# EAGLE design sherlock (EAGLE 6.5.0)
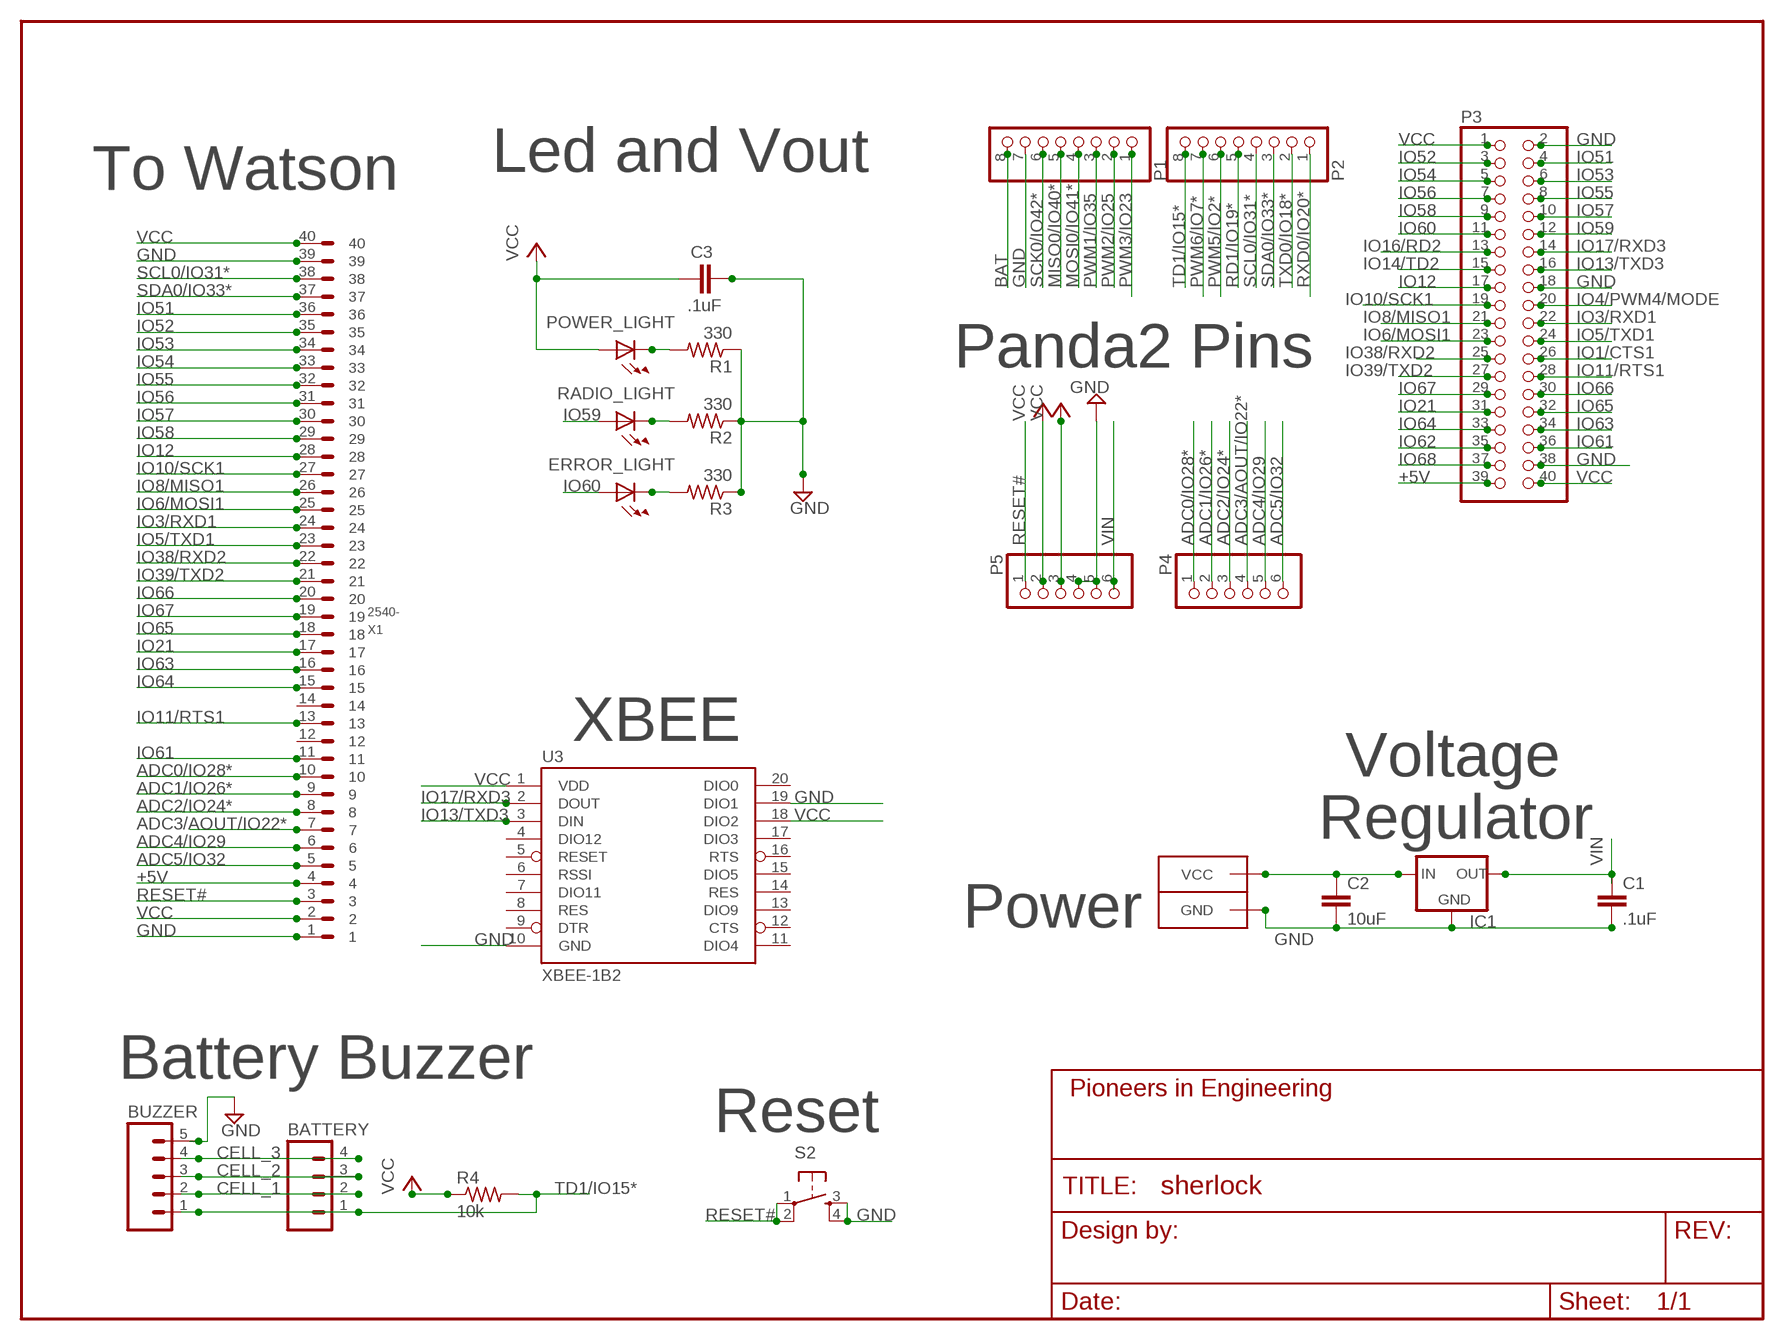
[diagram p0: schematic, sheet 1]
FRAME1 (FRAME-LETTER): AUTHOR: Sahar M, Michael C, Sumita G, Aravind K; REVISION: C

## Parts
BATTERY  M041X04-MTA  [1X04-MTA]
BUZZER  M05PTH  [1X05]
C1  .1uF  CAP0603-CAP  [0603-CAP]
C2  10uF  CAP0603-CAP  [0603-CAP]
C3  .1uF  CAP0603-CAP  [0603-CAP]
ERROR_LIGHT  LED0805  [LED-0805]
IC1  V_REG_78XXSIDE  [78XXL]
P1  PINHD-1X8  [1X08]
P2  PINHD-1X8  [1X08]
P3  PINHD-2X20  [2X20]
P4  PINHD-1X6  [1X06]
P5  PINHD-1X6  [1X06]
POWER  ANDERSONHORIZONTAL  [ANDERSON_HORIZONTAL]
POWER_LIGHT  LED0805  [LED-0805]
R1  330  R-US_R0603  [R0603]
R2  330  R-US_R0603  [R0603]
R3  330  R-US_R0603  [R0603]
R4  10k  R-US_R0603  [R0603]
RADIO_LIGHT  LED0805  [LED-0805]
S2  TAC_SWITCHPTH  [TACTILE-PTH]
U3  XBEE-1B2  [XBEE-SILK]
X1  2540-  [PAK100/2500-40]

## Nets
12V: C2.1 IC1.IN POWER.PIN2(VCC)
+5V [power]: P3.39 P5.3 X1.4 ; supply symbol labelled VCC
ADC0/IO28*: P4.1 X1.10
ADC1/IO26*: P4.2 X1.9
ADC2/IO24*: P4.3 X1.8
ADC3/AOUT/IO22*: P4.4 X1.7
ADC4/IO29: P4.5 X1.6
ADC5/IO32: P4.6 X1.5
BAT: P1.8
CELL_1: BATTERY.2 BUZZER.2
CELL_2: BATTERY.3 BUZZER.3
CELL_3: BATTERY.4 BUZZER.4
GND: BUZZER.5 C1.2 C2.2 C3.2 IC1.GND P1.7 P3.2 P3.18 P3.38 P5.4 P5.5 POWER.PIN1(GND) R1.1 R2.1 R3.1 S2.3 S2.4 U3.10(GND) U3.19(DIO1) X1.1 X1.39
IO1/CTS1: P3.26
IO3/RXD1: P3.22 X1.24
IO4/PWM4/MODE: P3.20
IO5/TXD1: P3.24 X1.23
IO6/MOSI1: P3.23 X1.25
IO8/MISO1: P3.21 X1.26
IO10/SCK1: P3.19 X1.27
IO11/RTS1: P3.28 X1.13
IO12: P3.17 X1.28
IO13/TXD3: P3.16 U3.3(DIN)
IO14/TD2: P3.15
IO16/RD2: P3.13
IO17/RXD3: P3.14 U3.2(DOUT)
IO21: P3.31 X1.17
IO38/RXD2: P3.25 X1.22
IO39/TXD2: P3.27 X1.21
IO51: P3.4 X1.36
IO52: P3.3 X1.35
IO53: P3.6 X1.34
IO54: P3.5 X1.33
IO55: P3.8 X1.32
IO56: P3.7 X1.31
IO57: P3.10 X1.30
IO58: P3.9 X1.29
IO59: P3.12 RADIO_LIGHT.A
IO60: ERROR_LIGHT.A P3.11
IO61: P3.36 X1.11
IO62: P3.35
IO63: P3.34 X1.16
IO64: P3.33 X1.15
IO65: P3.32 X1.18
IO66: P3.30 X1.20
IO67: P3.29 X1.19
IO68: P3.37
MISO0/IO40*: P1.5
MOSI0/IO41*: P1.4
N$2: POWER_LIGHT.C R1.2
N$3: R2.2 RADIO_LIGHT.C
N$4: ERROR_LIGHT.C R3.2
PWM1/IO35: P1.3
PWM2/IO25: P1.2
PWM3/IO23: P1.1
PWM5/IO2*: P2.6
PWM6/IO7*: P2.7
RD1/IO19*: P2.5
RESET#: P5.1 S2.1 S2.2 X1.3
RXD0/IO20*: P2.1
SCK0/IO42*: P1.6
SCL0/IO31*: P2.4 X1.38
SDA0/IO33*: P2.3 X1.37
TD1/IO15*: BATTERY.1 BUZZER.1 P2.8 R4.2
TXD0/IO18*: P2.2
VCC [power]: C3.1 P3.1 P3.40 P5.2 POWER_LIGHT.A R4.1 U3.1(VDD) U3.18(DIO2) X1.2 X1.40
VIN: C1.1 IC1.OUT P5.6
Unconnected: U3.4(DIO12) U3.5(RESET) U3.6(RSSI) U3.7(DIO11) U3.8(RES) U3.9(DTR) U3.11(DIO4) U3.12(CTS) U3.13(DIO9) U3.14(RES) U3.15(DIO5) U3.16(RTS) U3.17(DIO3) U3.20(DIO0) X1.12 X1.14

## Notes on the sheet
- To Watson | Led and Vout
- Panda2 Pins
- XBEE
- Voltage
- Regulator
- Power
- Battery Buzzer
- Reset

## Library data of the parts
BATTERY = pie:M04: 4-pin 0.1-inch header and MTA connector; PARTNUMBER: A1922-ND
BUZZER = pie:M05: 5-pin 0.1-inch header and MTA connector; PARTNUMBER: 965
C1-C3 = pie:CAP: Capacitor Standard 0603 ceramic capacitor, and 0.1" leaded capacitor.
ERROR_LIGHT POWER_LIGHT RADIO_LIGHT = pie:LED: LEDs Standard schematic elements and footprints for 5mm, 3mm, 1206, and 0603 sized LEDs. 5mm - Spark Fun Electronics SKU : COM-00529 (and others)
IC1 = pie:V_REG_78XX: Voltage Regulator Standard 7805 5V regulator. IGO (Input Ground Output). Spark Fun Electronics SKU : COM-00107; PARTNUMBER: 497-1446-5-ND
P1 P2 = pie:PINHD-1X8: 8-pin 0.1-inch header; PARTNUMBER: 965
P3 = pie:PINHD-2X20: 2x20-pin 0.1-inch header; PARTNUMBER: 966
P4 P5 = pie:PINHD-1X6: 6-pin 0.1-inch header; PARTNUMBER: 965
POWER = pie:ANDERSON: 2-pin 25A Anderson Connector http://www.alliedelec.com/images/products/datasheets/bm/ANDERSON_POWER_PRODUCTS/70162018.pdf; PARTNUMBER: 1377G1
R1-R4 = pie:R-US_: RESISTOR, American symbol
S2 = pie:TAC_SWITCH: Momentary Switch Button commonly used for reset or general input. Spark Fun Electronics SKU : COM-00097; PARTNUMBER: S5751-10-ND
U3 = pie:XBEE-1: XBee Header; PARTNUMBER: S5751-10-ND
X1 = pie:2540-: 3M (TM) Pak 100 4-Wall Header Source: 3M; OC_FARNELL: unknown; OC_NEWARK: unknown; PARTNUMBER: S9175-ND

## Net classes
1 power: width 0.406 mm, drill 0.381 mm, clearance 0.203 mm

## Board
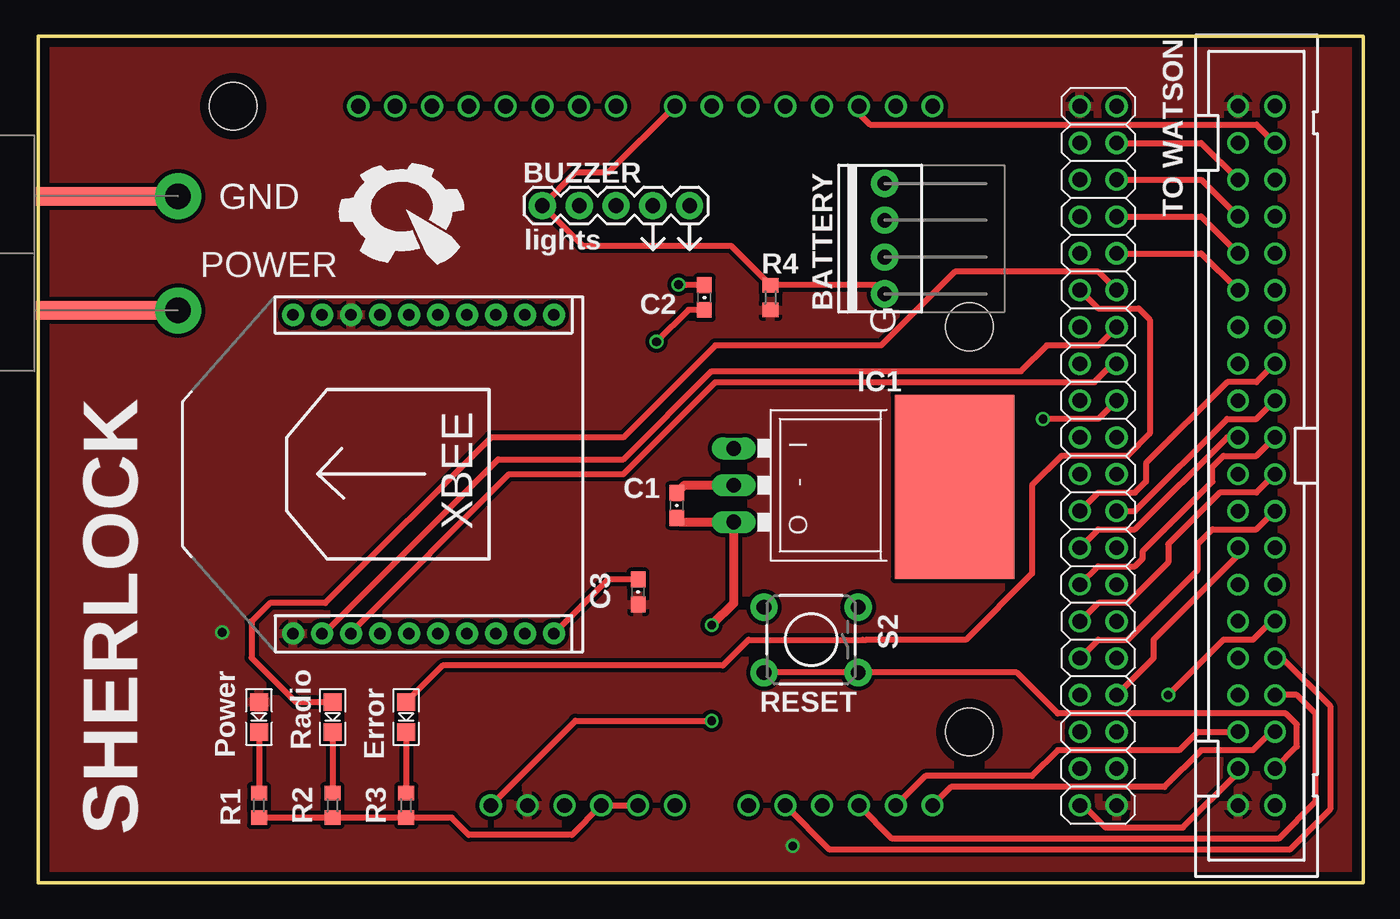
[diagram p1: board, top side]
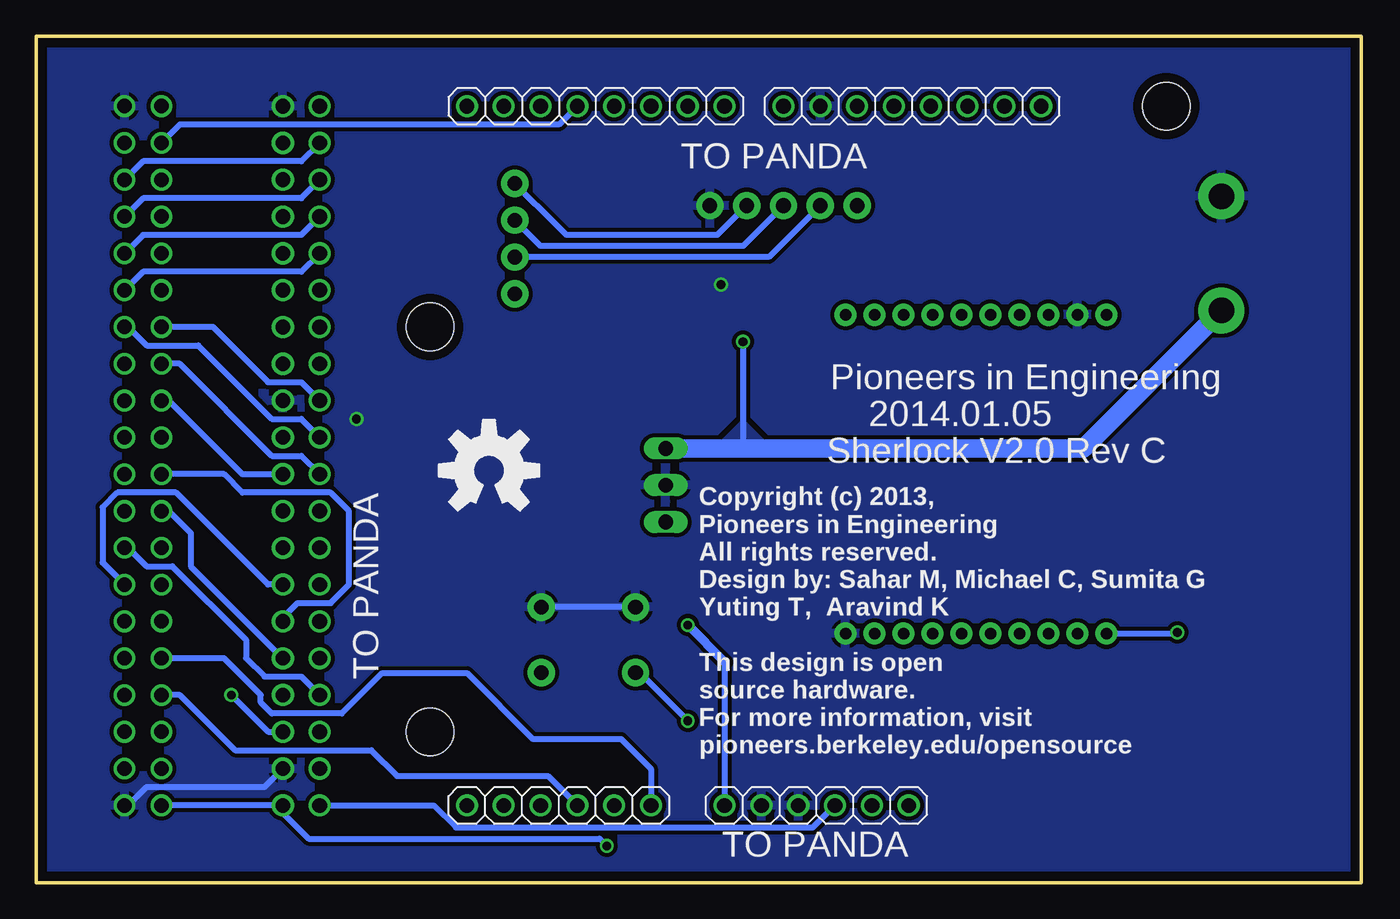
[diagram p2: board, bottom side, seen from below]

Size 91.44 x 58.42 mm. Coordinates in mm from the lower left corner, seen from the top.
Outline: 0,0 91.44,0 91.44,58.42 0,58.42 0,0
Copper layers (1*16): Top 2mil / dielectric 9mil / Bottom 2mil
Design rules "advancedcircuits-33each-pie": minimum track width 6mil, minimum drill 15mil, track to track 6mil, track to pad 10mil, pad to pad 6mil, via to via 6mil, smd to smd 6mil, copper to edge 25mil, drill to drill 7mil, minimum pad ring 7mil, minimum via ring 7mil, stop-mask expansion 3mil, vias tented up to drill 0mil, thermal gap 10mil

### Footprints (pad centres in the part's own frame; a part is rotated, then mirrored left to right if it is on the bottom)
1X04-MTA = drill 1.016 pad 1.88: 1 -3.81,0; 2 -1.27,0; 3 1.27,0; 4 3.81,0
1X05 = drill 1.016 pad 1.88: 1 -5.08,0; 2 -2.54,0; 3 0,0; 4 2.54,0; 5 5.08,0
0603-CAP = smd 1.1 x 1: 1 -0.85,0; 2 0.85,0
LED-0805 = smd 1.194 x 1.245: A -1.041,0; C 1.041,0
78XXL = drill 1.016 pad 1.524 long: GND 0,-8.89; IN -2.54,-8.89; OUT 2.54,-8.89 | smd 12.7 x 8.255: PAD 0.127,6.35
1X08 = drill 1.016 pad 1.524: 1 -8.89,0; 2 -6.35,0; 3 -3.81,0; 4 -1.27,0; 5 1.27,0; 6 3.81,0; 7 6.35,0; 8 8.89,0
2X20 = drill 1.016 pad 1.524: 1 -24.13,-1.27; 2 -24.13,1.27; 3 -21.59,-1.27; 4 -21.59,1.27; 5 -19.05,-1.27; 6 -19.05,1.27; 7 -16.51,-1.27; 8 -16.51,1.27; 9 -13.97,-1.27; 10 -13.97,1.27; 11 -11.43,-1.27; 12 -11.43,1.27; 13 -8.89,-1.27; 14 -8.89,1.27; 15 -6.35,-1.27; 16 -6.35,1.27; 17 -3.81,-1.27; 18 -3.81,1.27; 19 -1.27,-1.27; 20 -1.27,1.27; 21 1.27,-1.27; 22 1.27,1.27; 23 3.81,-1.27; 24 3.81,1.27; 25 6.35,-1.27; 26 6.35,1.27; 27 8.89,-1.27; 28 8.89,1.27; 29 11.43,-1.27; 30 11.43,1.27; 31 13.97,-1.27; 32 13.97,1.27; 33 16.51,-1.27; 34 16.51,1.27; 35 19.05,-1.27; 36 19.05,1.27; 37 21.59,-1.27; 38 21.59,1.27; 39 24.13,-1.27; 40 24.13,1.27
1X06 = drill 1.016 pad 1.524: 1 -6.35,0; 2 -3.81,0; 3 -1.27,0; 4 1.27,0; 5 3.81,0; 6 6.35,0
ANDERSON_HORIZONTAL = smd 8.89 x 1.27: P$1 -5.334,3.937; P$3 -5.334,-3.937 | drill 1.778 pad 3.175: PIN1 0,3.937; PIN2 0,-3.937
R0603 = smd 1 x 1.1: 1 -0.85,0; 2 0.85,0
TACTILE-PTH = drill 1.016 pad 1.88: 1 -3.251,2.261; 2 3.251,2.261; 3 -3.251,-2.261; 4 3.251,-2.261
XBEE-SILK = drill 0.8 pad 1.524: 1 -11,6.03; 2 -11,4.03; 3 -11,2.03; 4 -11,0.03; 5 -11,-1.97; 6 -11,-3.97; 7 -11,-5.97; 8 -11,-7.97; 9 -11,-9.97; 10 -11,-11.97; 11 11,-11.97; 12 11,-9.97; 13 11,-7.97; 14 11,-5.97; 15 11,-3.97; 16 11,-1.97; 17 11,0.03; 18 11,2.03; 19 11,4.03; 20 11,6.03
STAND-OFF = hole 3.302: 0,0
PAK100/2500-40 = drill 1 pad 1.5: 1 -24.13,-1.27; 2 -24.13,1.27; 3 -21.59,-1.27; 4 -21.59,1.27; 5 -19.05,-1.27; 6 -19.05,1.27; 7 -16.51,-1.27; 8 -16.51,1.27; 9 -13.97,-1.27; 10 -13.97,1.27; 11 -11.43,-1.27; 12 -11.43,1.27; 13 -8.89,-1.27; 14 -8.89,1.27; 15 -6.35,-1.27; 16 -6.35,1.27; 17 -3.81,-1.27; 18 -3.81,1.27; 19 -1.27,-1.27; 20 -1.27,1.27; 21 1.27,-1.27; 22 1.27,1.27; 23 3.81,-1.27; 24 3.81,1.27; 25 6.35,-1.27; 26 6.35,1.27; 27 8.89,-1.27; 28 8.89,1.27; 29 11.43,-1.27; 30 11.43,1.27; 31 13.97,-1.27; 32 13.97,1.27; 33 16.51,-1.27; 34 16.51,1.27; 35 19.05,-1.27; 36 19.05,1.27; 37 21.59,-1.27; 38 21.59,1.27; 39 24.13,-1.27; 40 24.13,1.27

### Placement (x,y rotation side)
BATTERY  58.42,44.45 90 top
BUZZER  39.88,46.74 0 top
C1  44.07,26.04 90 top
C2  45.97,40.39 90 top
C3  41.4,20.07 90 top
ERROR_LIGHT  25.4,11.43 270 top
IC1  56.9,27.43 270 top
P1  30.99,53.59 180 bottom
P2  52.83,53.59 0 bottom
P3  73.15,29.46 270 top
P4  55.37,5.33 180 bottom
P5  37.59,5.33 180 bottom
POWER  9.65,43.43 0 top
POWER_LIGHT  15.24,11.43 270 top
R1  15.24,5.33 90 top
R2  20.32,5.33 90 top
R3  25.4,5.33 90 top
R4  50.55,40.39 90 top
RADIO_LIGHT  20.32,11.43 270 top
S2  53.34,16.76 180 top
U3  23.62,28.19 90 top
U$1  [PIE-LOGO-SMALL]  25.4,46.48 0 top
U$3  Mounting + Test  [STAND-OFF]  64.26,38.35 0 top
U$4  Mounting  [STAND-OFF]  64.26,10.41 0 top
U$5  Mounting  [STAND-OFF]  13.46,53.59 0 top
U$7  [OSHW-LOGO-L]  60.2,28.45 0 bottom
X1  84.07,29.46 90 top

### Tracks (layer width: path | path; a pad name or v marks a point on that pad's centre or on a via)
12V  (via drill 0.6)
  Top 0.406: C2.1 44.87,39.54 v42.67,37.34
  Bottom 0.406: v42.67,37.34 42.67,30.23 42.93,29.97
  Bottom 1.27: IC1.IN 42.93,29.97 19.18,29.97 POWER.PIN2
  pour Bottom: 41.4,30.48 42.67,31.75 43.94,30.48
+5V
  Top 0.406: P3.39 72.14,5.33 73.66,3.81 78.99,3.81 82.68,7.49 82.8,7.49 X1.4
  Bottom 0.406: P3.39 64.01,5.33 62.48,3.81 37.85,3.81 P5.3
ADC0/IO28*
  Bottom 0.406: X1.10 78.49,15.49 75.95,12.95 75.95,12.45 75.18,11.68 70.36,11.68 67.56,14.48 61.72,14.48 57.15,9.91 51.05,9.91 49.02,7.87 P4.1
ADC1/IO26*
  Top 0.406: X1.9 85.85,15.49 89.15,12.19 89.15,5.08 86.36,2.29 54.61,2.29 P4.2
ADC2/IO24*
  Bottom 0.406: X1.8 81.53,12.95 77.72,9.14 68.33,9.14 66.55,7.37 56.13,7.37 P4.3
ADC3/AOUT/IO22*
  Top 0.406: X1.7 86.87,12.95 88.14,11.68 88.14,5.59 85.6,3.05 58.93,3.05 P4.4
ADC4/IO29
  Top 0.406: X1.6 80.01,10.41 78.74,9.14 70.36,9.14 68.58,7.37 61.21,7.37 P4.5
ADC5/IO32
  Top 0.406: X1.5 85.09,10.41 83.82,9.14 80.26,9.14 77.72,6.6 62.99,6.6 P4.6
CELL_1
  Bottom 0.406: BUZZER.2 40.89,43.18 BATTERY.2
CELL_2
  Bottom 0.406: BUZZER.3 42.67,43.94 56.64,43.94 BATTERY.3
CELL_3
  Bottom 0.406: BATTERY.4 55.5,45.34 55.37,45.21 54.86,44.7 44.45,44.7 BUZZER.4
GND  (via drill 0.6)
  Top 0.406: P5.5 P5.4 36.83,3.3 29.72,3.3 28.54,4.48 R3.1 R2.1 R1.1 | P3.18 73.15,32 v69.34,32 | C3.2 41.38,20.94 39.34,20.94 U3.10 | C2.2 44.23,41.24 v44.2,41.27
  Top 0.61: C1.2 44.62,27.43 IC1.GND
  Bottom 0.406: 85.09,5.33 83.82,6.6 75.69,6.6 P3.38 | S2.4 S2.3
  pour Bottom (isolate 0.279, rank 2): 0,0 91.44,0 91.44,58.42 0,58.42
IO3/RXD1
  Bottom 0.406: P3.22 77.22,28.19 82.3,33.27 X1.24
IO5/TXD1
  Top 0.406: P3.24 75.69,25.65 82.04,32 84.07,32 X1.23
IO6/MOSI1
  Top 0.406: X1.25 84.07,34.54 82.04,34.54 76.45,28.96 76.45,27.69 75.69,26.92 73.15,26.92 P3.23
IO8/MISO1
  Bottom 0.406: P3.21 73.15,29.46 75.18,29.46 81.53,35.81 X1.26
IO10/SCK1
  Bottom 0.406: P3.19 73.15,32 75.18,32 80.26,37.08 83.82,37.08 85.09,38.35 X1.27
IO11/RTS1
  Bottom 0.406: P3.28 75.44,20.57 81.79,26.92 85.85,26.92 86.87,25.91 86.87,22.1 X1.13
IO12
  Bottom 0.406: P3.17 73.15,34.54 75.44,34.54 79.25,38.35 X1.28
IO13/TXD3
  Top 0.406: U3.3 21.59,17.27 32.51,28.19 40.39,28.19 46.74,34.54 72.9,34.54 74.17,35.81 P3.16
IO17/RXD3
  Top 0.406: P3.14 73.15,37.08 69.6,37.08 67.82,35.31 46.48,35.31 40.39,29.21 31.75,29.21 19.73,17.19 U3.2
IO21
  Top 0.406: P3.31 73.15,16.76 75.18,16.76 80.01,21.59 80.01,23.37 81.03,24.38 84.07,24.38 X1.17
IO38/RXD2
  Top 0.406: P3.25 73.15,24.38 75.69,24.38 82.04,30.73 X1.22
IO39/TXD2
  Top 0.406: P3.27 73.15,21.84 75.69,21.84 76.2,22.35 76.2,22.86 81.03,27.69 81.03,28.7 81.79,29.46 84.07,29.46 X1.21
IO51
  Top 0.406: P3.4 80.26,51.05 X1.36
IO52
  Bottom 0.406: P3.3 73.15,49.78 84.07,49.78 X1.35
IO53
  Top 0.406: P3.6 80.26,48.51 X1.34
IO54
  Bottom 0.406: P3.5 73.15,47.24 84.07,47.24 X1.33
IO55
  Top 0.406: P3.8 80.26,45.97 X1.32
IO56
  Bottom 0.406: P3.7 73.15,44.7 84.07,44.7 X1.31
IO57
  Top 0.406: P3.10 80.26,43.43 X1.30
IO58
  Bottom 0.406: P3.9 73.15,42.16 84.07,42.16 X1.29
IO59
  Top 0.406: P3.12 73.15,42.16 63.25,42.16 58.17,37.08 46.74,37.08 40.39,30.73 31.24,30.73 19.81,19.3 16,19.3 14.73,18.03 14.73,15.52 17.78,12.47 RADIO_LIGHT.A
IO60
  Top 0.406: P3.11 73.15,39.62 75.95,39.62 76.71,38.86 76.71,30.99 75.18,29.46 70.61,29.46 68.58,27.43 68.58,21.34 64.01,16.76 57.15,16.76 56.9,16.76 49.02,16.76 47.24,14.99 27.91,14.99 ERROR_LIGHT.A
IO61  (via drill 0.6)
  Top 0.406: v77.98,12.95 81.79,16.76 83.82,16.76 85.09,18.03 X1.11
  Bottom 0.406: v77.98,12.95 75.44,10.41 P3.36
IO63
  Top 0.406: P3.34 76.96,15.49 76.96,16.76 82.68,22.48 82.68,22.99 X1.16
IO64
  Bottom 0.406: P3.33 73.15,14.22 75.69,14.22 76.96,15.49 76.96,16.76 82.04,21.84 83.82,21.84 84.71,22.73 84.96,22.73 X1.15
IO65
  Bottom 0.406: P3.32 80.77,21.84 80.77,24.13 82.3,25.65 X1.18
IO66
  Bottom 0.406: P3.30 74.42,18.29 73.41,19.3 71.12,19.3 69.85,20.57 69.85,25.65 71.12,26.92 77.22,26.92 78.49,28.19 X1.20
IO67
  Top 0.406: P3.29 73.15,19.3 75.18,19.3 77.98,22.1 77.98,23.37 81.53,26.92 84.07,26.92 X1.19
N$2
  Top 0.406: POWER_LIGHT.C R1.2
N$3
  Top 0.406: RADIO_LIGHT.C R2.2
N$4
  Top 0.406: ERROR_LIGHT.C R3.2
RESET#  (via drill 0.6)
  Top 0.406: v46.48,11.18 37.08,11.18 P5.1 | X1.3 86.87,9.4 86.87,10.92 86.11,11.68 70.36,11.68 67.54,14.5 S2.1 S2.2
  Bottom 0.406: v46.48,11.18 49.81,14.5 S2.2
SCL0/IO31*
  Bottom 0.406: X1.38 81.53,52.32 55.37,52.32 P2.4
SDA0/IO33*
  Top 0.406: X1.37 84.07,52.32 57.4,52.32 56.64,53.09 P2.3
TD1/IO15*
  Top 0.406: BATTERY.1 57.82,41.24 R4.2 47.84,43.94 37.59,43.94 BUZZER.1 37.08,49.02 39.37,49.02 P2.8
VCC  (via drill 0.6)
  Top 0.406: v52.07,2.54 52.07,2.79
  Bottom 0.406: v52.07,2.54 52.58,3.05 72.64,3.05 74.42,4.83 P3.40 X1.2 | U3.1 12.78,17.19 v12.7,17.27
  pour Top (isolate 0.279): 0,0 91.44,0 91.44,58.42 0,58.42
VIN  (via drill 0.6)
  Top 0.61: v46.48,17.78 48.01,19.3 IC1.OUT 44.36,24.89 C1.1
  Bottom 0.406: 43.94,15.24 P5.6
  Bottom 0.61: 43.94,15.24 v46.48,17.78

### Text on the board
tPlace: GND | TO WATSON | lights | G | Radio | RESET | Power | Error | SHERLOCK
bPlace: TO PANDA | Pioneers in Engineering | 2014.01.05 | Sherlock V2.0 Rev C | TO PANDA | Copyright (c) 2013, / Pioneers in Engineering / All rights reserved. / Design by: Sahar M, Michael C, Sumita G / Yuting T, Aravind K / / This design is open / source hardware. / For more information, visit / pioneers.berkeley.edu/opensource | TO PANDA